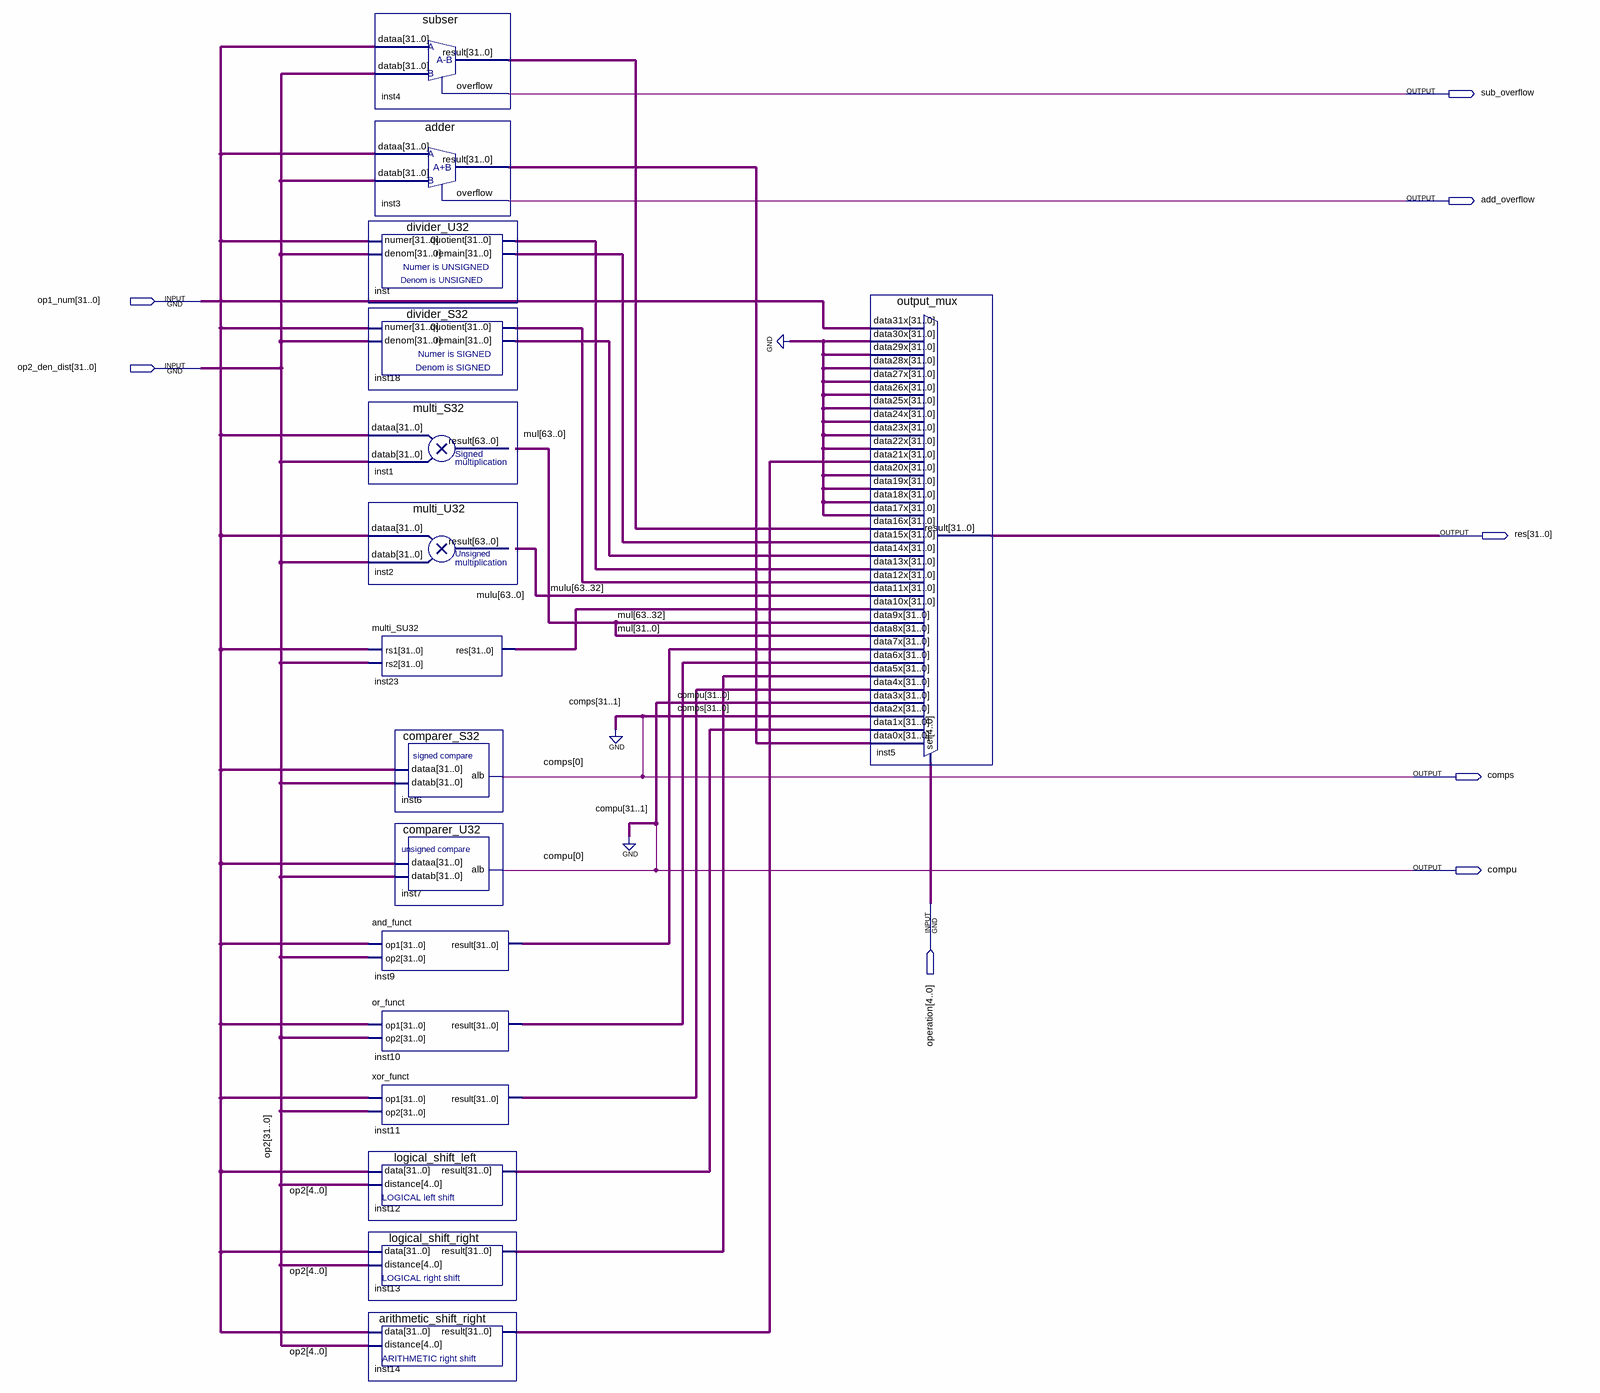
[diagram p0: schematic sheet]
// Quartus schematic ALU.bdf as structural Verilog: 16 symbols, 8 pins
module ALU (
  input  [31:0] op1_num,
  input  [31:0] op2_den_dist,
  input  [4:0] operation,
  output sub_overflow,
  output add_overflow,
  output [31:0] res,
  output comps,
  output compu
);

  wire [31:0] inst3_result, inst4_result, inst9_result, inst10_result, inst11_result, inst12_result,
       inst13_result, inst14_result, inst18_quotient, inst18_remain, inst23_res, inst_quotient, inst_remain;
  wire [63:0] mul, mulu;

  subser inst4 (.dataa(op1_num), .datab(op2_den_dist), .result(inst4_result), .overflow(sub_overflow));
  adder inst3 (.dataa(op1_num), .datab(op2_den_dist), .result(inst3_result), .overflow(add_overflow));
  divider_U32 inst (.numer(op1_num), .denom(op2_den_dist), .quotient(inst_quotient), .remain(inst_remain));
  divider_S32 inst18 (.numer(op1_num), .denom(op2_den_dist), .quotient(inst18_quotient), .remain(inst18_remain));
  multi_S32 inst1 (.dataa(op1_num), .datab(op2_den_dist), .result(mul));
  multi_U32 inst2 (.dataa(op1_num), .datab(op2_den_dist), .result(mulu));
  multi_SU32 inst23 (.rs1(op1_num), .rs2(op2_den_dist), .res(inst23_res));
  comparer_S32 inst6 (.dataa(op1_num), .datab(op2_den_dist), .alb(comps));
  comparer_U32 inst7 (.dataa(op1_num), .datab(op2_den_dist), .alb(compu));
  and_funct inst9 (.op1(op1_num), .op2(op2_den_dist), .result(inst9_result));
  or_funct inst10 (.op1(op1_num), .op2(op2_den_dist), .result(inst10_result));
  xor_funct inst11 (.op1(op1_num), .op2(op2_den_dist), .result(inst11_result));
  logical_shift_left inst12 (.data(op1_num), .distance(op2_den_dist[4:0]), .result(inst12_result));
  logical_shift_right inst13 (.data(op1_num), .distance(op2_den_dist[4:0]), .result(inst13_result));
  arithmetic_shift_right inst14 (.data(op1_num), .distance(op2_den_dist[4:0]), .result(inst14_result));
  output_mux inst5 (
    .data31x(op1_num), .data30x({32{1'b0}}), .data29x({32{1'b0}}), .data28x({32{1'b0}}),
    .data27x({32{1'b0}}), .data26x({32{1'b0}}), .data25x({32{1'b0}}), .data24x({32{1'b0}}),
    .data23x({32{1'b0}}), .data22x({32{1'b0}}), .data21x(inst14_result), .data20x({32{1'b0}}),
    .data19x({32{1'b0}}), .data18x({32{1'b0}}), .data17x({32{1'b0}}), .data16x(inst4_result),
    .data15x(inst_remain), .data14x(inst18_remain), .data13x(inst_quotient), .data12x(inst18_quotient),
    .data11x(mulu[63:32]), .data10x(inst23_res), .data9x(mul[63:32]), .data8x(mul[31:0]),
    .data7x(inst9_result), .data6x(inst10_result), .data5x(inst13_result), .data4x(inst11_result),
    .data3x({{31{1'b0}}, compu}), .data2x({{31{1'b0}}, comps}), .data1x(inst12_result),
    .data0x(inst3_result), .sel(operation), .result(res));

  // Other names for the same wires on the sheet: comps[0] = comps; compu[0] = compu; op2[31:0] = op2_den_dist
endmodule
